# EAGLE design 9-Pin Mini DIN Breakout PCB v1 (EAGLE 9.6.2)
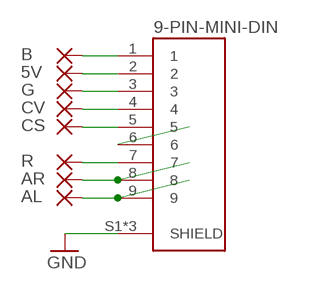
[diagram p0: schematic, sheet 1]

## Parts
5V  PADSRECTANGLE-1,27X2,54  [RECTANGLE-1,27X2,54]
9-PIN-MINI-DIN  9-PIN-MINI-DIN  [9-PIN-MINI-DIN]
AL  PADSRECTANGLE-1,27X2,54  [RECTANGLE-1,27X2,54]
AR  PADSRECTANGLE-1,27X2,54  [RECTANGLE-1,27X2,54]
B  PADSRECTANGLE-1,27X2,54  [RECTANGLE-1,27X2,54]
CS  PADSRECTANGLE-1,27X2,54  [RECTANGLE-1,27X2,54]
CV  PADSRECTANGLE-1,27X2,54  [RECTANGLE-1,27X2,54]
G  PADSRECTANGLE-1,27X2,54  [RECTANGLE-1,27X2,54]
R  PADSRECTANGLE-1,27X2,54  [RECTANGLE-1,27X2,54]

## Nets
5V: 5V.1(P) 9-PIN-MINI-DIN.2
AL: 9-PIN-MINI-DIN.9 AL.1(P)
AM: 9-PIN-MINI-DIN.6
AR: 9-PIN-MINI-DIN.8 AR.1(P)
B: 9-PIN-MINI-DIN.1 B.1(P)
CS: 9-PIN-MINI-DIN.5 CS.1(P)
CV: 9-PIN-MINI-DIN.4 CV.1(P)
G: 9-PIN-MINI-DIN.3 G.1(P)
GND: 9-PIN-MINI-DIN.S1(SHIELD) 9-PIN-MINI-DIN.S2(SHIELD) 9-PIN-MINI-DIN.S3(SHIELD)
R: 9-PIN-MINI-DIN.7 R.1(P)

## Library data of the parts
5V AL AR B CS CV G R = Consoles Unleashed Eagle Parts Library:PADS: PADS to connect wires to PCB
9-PIN-MINI-DIN = Consoles Unleashed Eagle Parts Library:9-PIN-MINI-DIN: 9-Pin Mini DIN

## Board
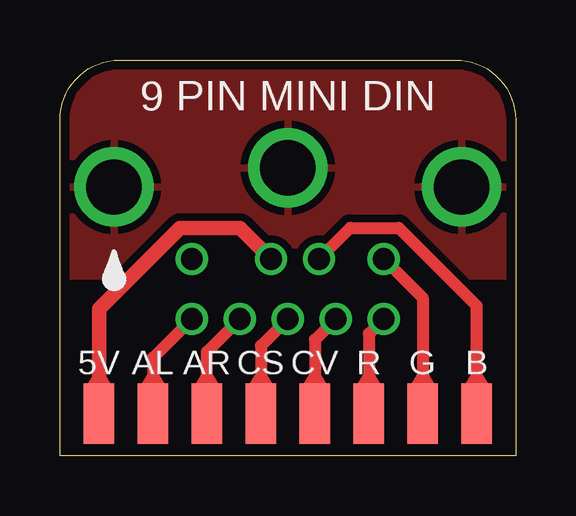
[diagram p1: board, top side]
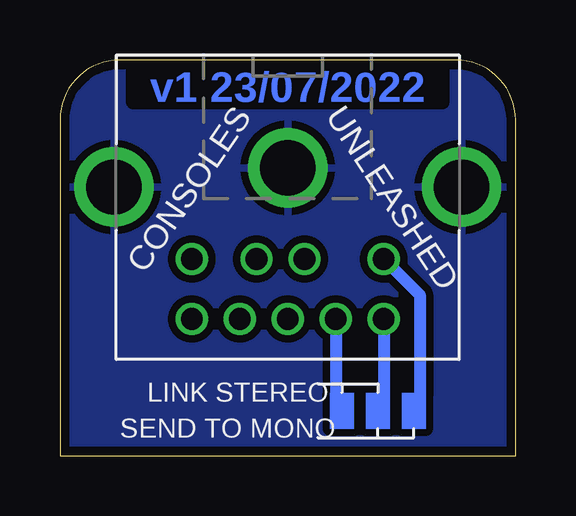
[diagram p2: board, bottom side, seen from below]

Size 19 x 16.5 mm. Coordinates in mm from the lower left corner, seen from the top.
Outline: 0,0 0,14 arc-90 2.5,16.5 16.5,16.5 arc-90 19,14 19,0 0,0
Copper layers (1*16): Top 0.035559375mm / dielectric 1.6mm / Bottom 0.035559375mm
Design rules "oshpark-2layer *": minimum track width 6mil, minimum drill 10mil, track to track 6mil, track to pad 6mil, pad to pad 6mil, via to via 6mil, smd to smd 6mil, copper to edge 15mil, drill to drill 6mil, minimum pad ring 5mil, minimum via ring 5mil, stop-mask expansion 2.5mil, vias tented up to drill 1mm, thermal gap 12mil

### Footprints (pad centres in the part's own frame; a part is rotated, then mirrored left to right if it is on the bottom)
RECTANGLE-1,27X2,54 = smd 1.27 x 2.54: 1 0,0
9-PIN-MINI-DIN = drill 0.9: 1 -1.3,-3.8; 2 0.7,-3.8; 3 -4,-3.8; 4 -2,-6.3; 5 0,-6.3; 6 4,-3.8; 7 -4,-6.3; 8 2,-6.3; 9 4,-6.3 | drill 2.3: S1 0,0; S2 -7.25,-0.8; S3 7.25,-0.8

### Placement (x,y rotation side)
5V  1.62,1.75 0 top
9-PIN-MINI-DIN  9.5,12 0 bottom
AL  3.88,1.75 0 top
AR  6.12,1.75 0 top
B  17.38,1.75 0 top
CS  8.38,1.75 0 top
CV  10.62,1.75 0 top
G  15.12,1.75 0 top
R  12.88,1.75 0 top

### Tracks (layer width: path | path; a pad name or v marks a point on that pad's centre or on a via)
5V
  Top 0.305: 1.25,2.88 2,2.88 1.62,3.5 1.25,2.88
  Top 0.61: 9-PIN-MINI-DIN.2 7.5,9.5 5,9.5 1.62,6.12 5V.1
AL
  Top 0.305: 3.5,2.88 4.25,2.88 3.88,3.5 3.5,2.88
  Top 0.406: AL.1 3.88,2
  Top 0.508: 9-PIN-MINI-DIN.9 3.88,4.08 3.88,2
  Bottom 0.508: 9-PIN-MINI-DIN.9 5.5,2.5
AM
  Bottom 0.508: 9-PIN-MINI-DIN.6 4,6.7 4,2.5
AR
  Top 0.305: 5.75,2.88 6.5,2.88 6.12,3.5 5.75,2.88
  Top 0.508: AR.1 6.12,4.33 9-PIN-MINI-DIN.8
  Bottom 0.508: 9-PIN-MINI-DIN.8 7.5,2.5
B
  Top 0.305: 17,2.88 17.75,2.88 17.38,3.5 17,2.88
  Top 0.508: 9-PIN-MINI-DIN.1 12.1,9.5 14.12,9.5 17.38,6.25 B.1
CS
  Top 0.305: 8,2.88 8.75,2.88 8.38,3.5 8,2.88
  Top 0.508: 9-PIN-MINI-DIN.5 8.38,4.58 CS.1
CV
  Top 0.305: 10.25,2.88 11,2.88 10.62,3.5 10.25,2.88
  Top 0.508: 9-PIN-MINI-DIN.4 10.62,4.83 CV.1
G
  Top 0.305: 14.75,2.88 15.5,2.88 15.12,3.5 14.75,2.88
  Top 0.508: 9-PIN-MINI-DIN.3 15.12,6.58 G.1
GND
  pour Top (isolate 0.305): 0,7.5 0,14 arc-90 2.5,16.5 16.5,16.5 arc-90 19,14 19,7.5
  pour Bottom (isolate 0.305): 0,0 0,14 arc-90 2.5,16.5 16.5,16.5 arc-90 19,14 19,0
R
  Top 0.305: 12.5,2.88 13.25,2.88 12.88,3.5 12.5,2.88
  Top 0.508: R.1 12.88,5.08 9-PIN-MINI-DIN.7
(copper drawn outside any net)
  shapes: Bottom area x3

### Text on the board
Bottom: v1 23/07/2022
tNames: 9 PIN MINI DIN | 5V | AL | AR | CS | CV | R | G | B
bNames: UNLEASHED | CONSOLES | LINK STEREO | SEND TO MONO